# Altium schematic sheet ESP8266-12x.SchDoc
size A4; SheetNumber: 6; SheetTotal: 12
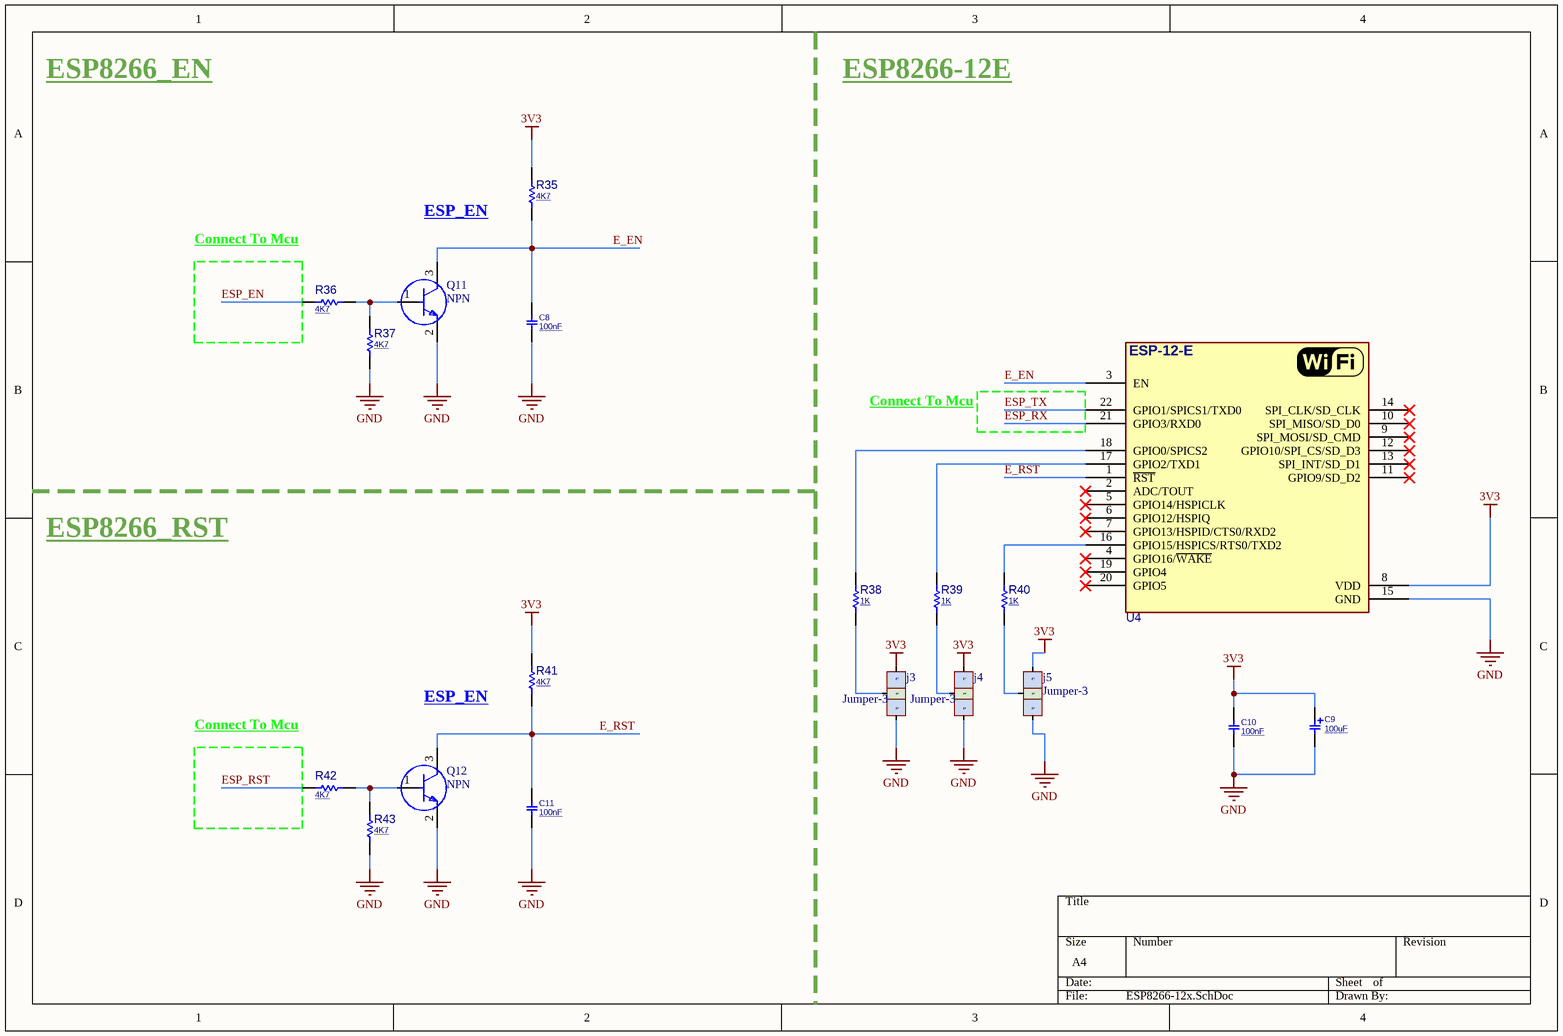
[diagram p0: ESP8266-12x.SchDoc]

## Parts
C8  100nF  [C0603]
C9  value 100uF  [C_TN_3216]  (hidden comment: 4.7uF)
C10  100nF  [C0603]
C11  100nF  [C0603]
j3  Jumper-3  [jumper-3]
j4  Jumper-3  [jumper-3]
j5  Jumper-3  [jumper-3]
Q11  NPN  [FP-SOT23-IPC_A]
Q12  NPN  [FP-SOT23-IPC_A]
R35  4K7  [R0603]
R36  4K7  [R0603]
R37  4K7  [R0603]
R38  1K  [R0603]
R39  1K  [R0603]
R40  1K  [R0603]
R41  4K7  [R0603]
R42  4K7  [R0603]
R43  4K7  [R0603]
U4  (no value)  [ESP8266_ESP12E]

## Nets
3V3: C9.1 C10.2 j3.3 j4.3 j5.3 R35.2 R41.2 U4.8(VDD)
GND: C8.1 C9.2 C10.1 C11.1 j3.1 j4.1 j5.1 Q11.2(E) Q12.2(E) R37.1 R43.1 U4.15(GND)
E_EN: C8.2 Q11.3(C) R35.1 U4.3(EN)
E_RST: C11.2 Q12.3(C) R41.1 U4.1(~{RST})
ESP_EN: R36.1
ESP_RST: R42.1
ESP_RX: U4.21(GPIO3/RXD0)
ESP_TX: U4.22(GPIO1/SPICS1/TXD0)
Netj3_2: j3.2 R38.1
Netj4_2: j4.2 R39.1
Netj5_2: j5.2 R40.1
NetQ11_1: Q11.1(B) R36.2 R37.2
NetQ12_1: Q12.1(B) R42.2 R43.2
NetR38_2: R38.2 U4.18(GPIO0/SPICS2)
NetR39_2: R39.2 U4.17(GPIO2/TXD1)
NetR40_2: R40.2 U4.16(GPIO15/HSPICS/RTS0/TXD2)

Not connected (* = marked no-connect by the designer): U4 2(ADC/TOUT)* 4(GPIO16/~{WAKE})* 5(GPIO14/HSPICLK)* 6(GPIO12/HSPIQ)* 7(GPIO13/HSPID/CTS0/RXD2)* 9(SPI_MOSI/SD_CMD)* 10(SPI_MISO/SD_D0)* 11(GPIO9/SD_D2)* 12(GPIO10/SPI_CS/SD_D3)* 13(SPI_INT/SD_D1)* 14(SPI_CLK/SD_CLK)* 19(GPIO4)* 20(GPIO5)*

## Notes on the sheet
- ESP8266_EN
- ESP8266-12E
- Connect To Mcu
- ESP_EN
- ESP8266_RST
- (in symbol ESP8266 ESP-12-E) ESP-12-E
- (in symbol Jumper-3) C; B; A

## Library data of the parts
C8 C10 C11 = CAP_SMD_MLCC_0603: CAP, MLCC, -F, -V, MATERIAL, -%, 0201; PARAM: -, -%; MANF_P#: MANF_PART#; PRICE: 100= 1$; MANF: -; PARAM2: -V; ASSEMBLY: ASSEMBLY; VALUE: 100nF
C9 = CAP_SMD_TAN_3216: CAP, SMD, TAN,; PARAM2: -V
Q11 Q12 = CMP-2000-04931-2: Frequency: 300MHz; Collector Emitter Voltage (VCEO): 40V; Power Dissipation: 350mW; Element Configuration: Single; Max Power Dissipation: 300mW; Max Collector Current: 200mA; Collector Emitter Saturation Voltage: 300mV; Number of Elements: 1; hFE Min: 100; Collector Base Voltage (VCBO): 60V; Emitter Base Voltage (VEBO): 6V; Contact Plating: Tin; Package Quantity: 3000; Max Frequency: 300MHz; REACH SVHC: No SVHC; Max Operating Temperature: 150°C; Width: 1.4mm; Voltage Rating (DC): 40V; Radiation Hardening: No; Case/Package: SOT-23; Height: 1mm; Collector Emitter Breakdown Voltage: 40V; Length: 3.05mm; Polarity: NPN; Packaging: Tape and Reel; Number of Pins: 3; Min Operating Temperature: -55°C; Gain Bandwidth Product: 300MHz; Mount: Surface Mount; Weight: 0.000282oz; Continuous Collector Current: 200mA; Transition Frequency: 300MHz; Max Breakdown Voltage: 40V; Lead Free: Lead Free
R35-R43 = RES_SMD: RESISTOR, SMD; PARAM: -W; DESC: DESCRIPTION; DIST#: MOUSER; PARAM2: 1%; MANF_P#: -; MANF: -; ASSEMBLY: ASSEMBLY; PRICE: 100= 0.5$
  R35-R37 R41-R43: VALUE: 4K7
  R38-R40: VALUE: 1K
U4 = ESP8266 ESP-12-E: ESP8266 ESP-12 Wi-Fi Module; ComponentLink1Description: Website Smart World; ComponentLink1URL: https://www.smartw.ir/; DatasheetVersion: 2021; ComponentLink2Description: Telegram; ComponentLink2URL: https://t.me/altium_smartw; ComponentLink3Description: Instagram; ComponentLink3URL: https://Instagram.com/smartgw.ir